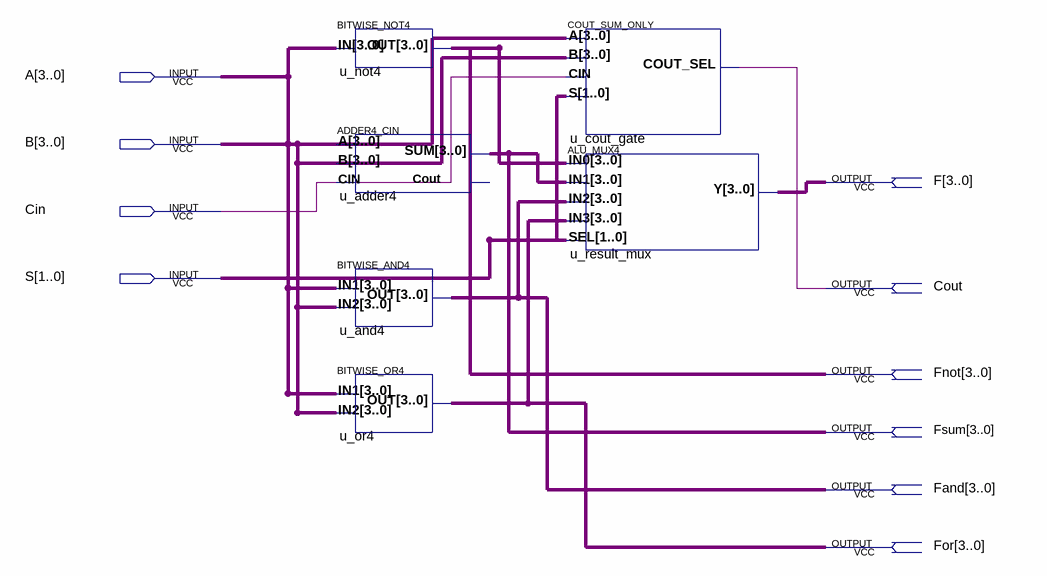
[diagram p0: schematic sheet]
// Quartus schematic Lab4_ALU.bdf as structural Verilog: 6 symbols, 10 pins
module Lab4_ALU (
  input  [3:0] A,
  input  [3:0] B,
  input  Cin,
  input  [1:0] S,
  output [3:0] F,
  output Cout,
  output [3:0] Fnot,
  output [3:0] Fsum,
  output [3:0] Fand,
  output [3:0] For
);

  BITWISE_NOT4 u_not4 (.IN(A), .OUT(Fnot));
  ADDER4_CIN u_adder4 (.A(A), .B(A), .CIN(Cin), .SUM(Fsum));  // open: Cout
  BITWISE_AND4 u_and4 (.IN1(A), .IN2(A), .OUT(Fand));
  BITWISE_OR4 u_or4 (.IN1(A), .IN2(A), .OUT(For));
  COUT_SUM_ONLY u_cout_gate (.A(A), .B(A), .CIN(Cin), .S(S), .COUT_SEL(Cout));
  ALU_MUX4 u_result_mux (.IN0(Fnot), .IN1(Fsum), .IN2(Fand), .IN3(For), .SEL(S), .Y(F));

  assign B = A;
endmodule
